# Altium schematic sheet WIFI_Display.SchDoc: WIFI, Display, Encoder
size A4; Date: 18.12.2015; Engineer: Matjaz Tome; DocumentNumber: 7; Revision: B1; SheetNumber: 7; SheetTotal: 8; Project: USB DAQ
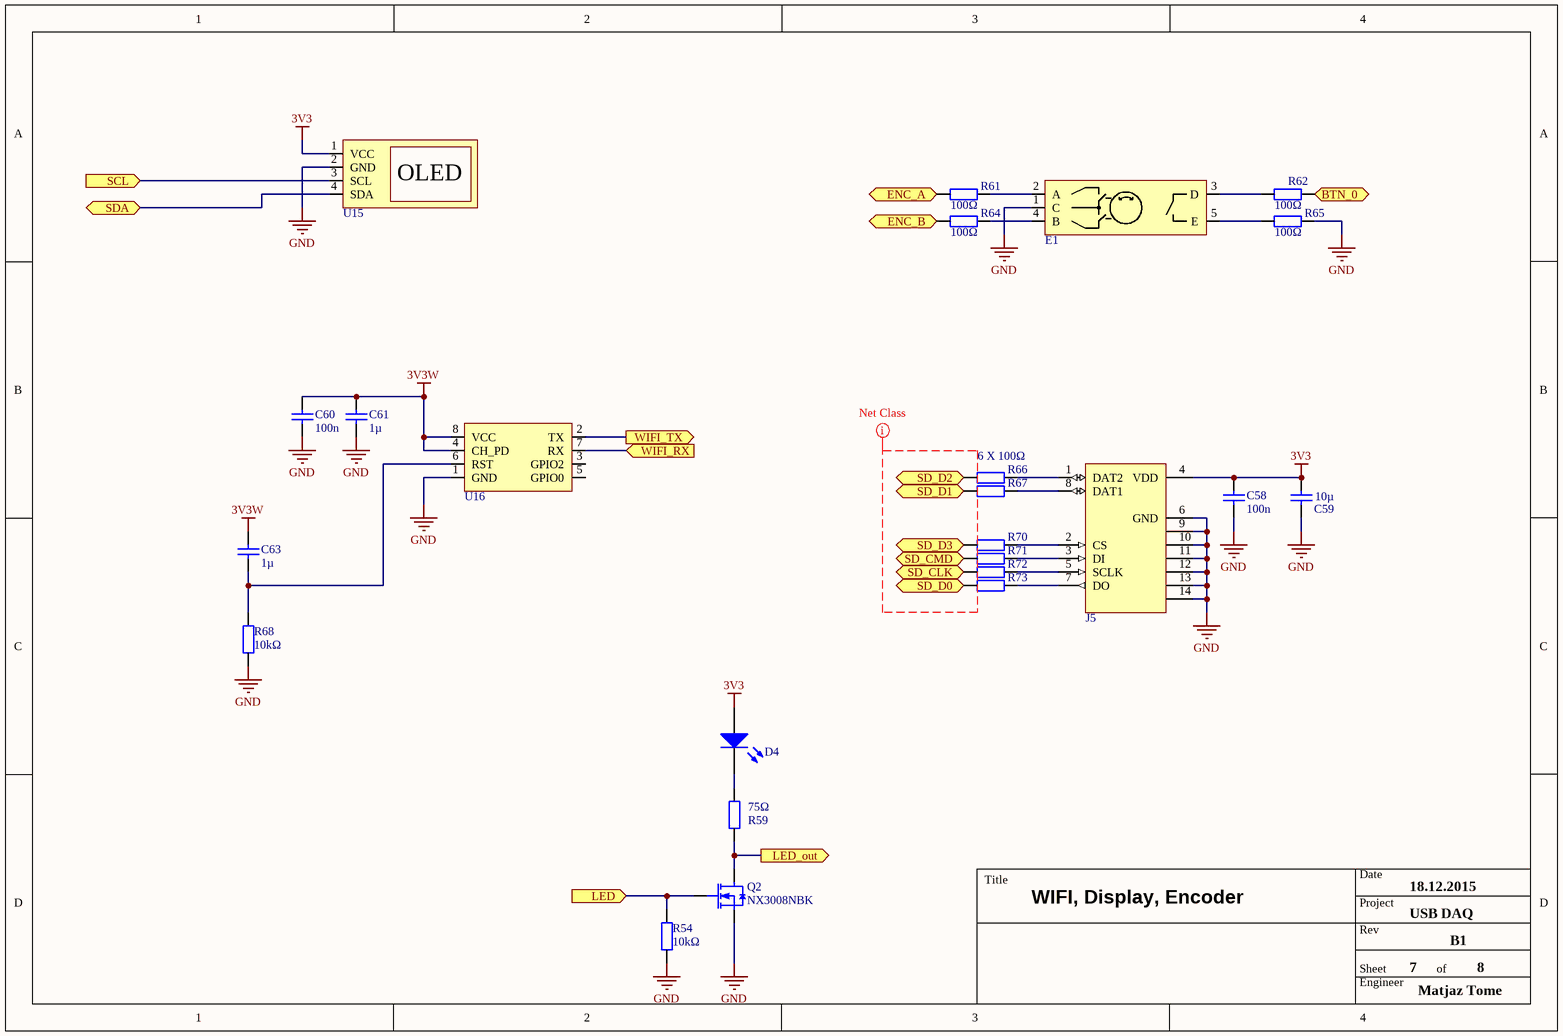
[diagram p0: WIFI_Display.SchDoc]

## Parts
C58  100n  [0603C]
C59  10µ  [0805C]
C60  100n  [0603C]
C61  1µ  [0603C]
C63  1µ  [0603C]
D4  KPT-2012SGC  [LED0805]  (value not drawn)
E1  EC12D  [EC12D]  (value not drawn)
J5  SD card  [MICRO_SD_AMPHENOL]  (value not drawn)
Q2  NX3008NBK  [SOT23-3]
R54  10kΩ  [0603R]
R59  75Ω  [0603R]
R61  100Ω  [0603R]
R62  100Ω  [0603R]
R64  100Ω  [0603R]
R65  100Ω  [0603R]
R66  100Ω  [0603R]  (value not drawn)
R67  100Ω  [0603R]  (value not drawn)
R68  10kΩ  [0603R]
R70  100Ω  [0603R]  (value not drawn)
R71  100Ω  [0603R]  (value not drawn)
R72  100Ω  [0603R]  (value not drawn)
R73  100Ω  [0603R]  (value not drawn)
U15  SSD1306  [OLED1]  (value not drawn)
U16  ESP-01  [ESP-01]  (value not drawn)

## Ports
BTN_0 (out), ENC_A (out), ENC_B (out), LED (in), LED_out (out), SCL (in), SD_CLK (in), SD_CMD (in), SD_D0 (bidir), SD_D1 (bidir), SD_D2 (bidir), SD_D3 (bidir), SDA (bidir), WIFI_RX (in), WIFI_TX (out)

## Nets
3V3: C58.1 C59.2 D4.A J5.4(VDD) U15.1(VCC)
3V3W: C60.1 C61.2 C63.2 U16.4(CH_PD) U16.8(VCC)
GND: C58.2 C59.1 C60.2 C61.1 E1.1(C) J5.6(GND) J5.9 J5.10 J5.11 J5.12 J5.13 J5.14 Q2.2(S) R54.1 R65.2 R68.1 U15.2(GND) U16.1(GND)
BTN_0: R62.2 ; port BTN_0
ENC_A: R61.1 ; port ENC_A
ENC_B: R64.1 ; port ENC_B
LED: Q2.1(G) R54.2 ; port LED
LED_out: Q2.3(D) R59.1 ; port LED_out
SCL: U15.3(SCL) ; port SCL
SD_CLK: R72.1 ; port SD_CLK
SD_CMD: R71.1 ; port SD_CMD
SD_D0: R73.1 ; port SD_D0
SD_D1: R67.1 ; port SD_D1
SD_D2: R66.1 ; port SD_D2
SD_D3: R70.1 ; port SD_D3
SDA: U15.4(SDA) ; port SDA
WIFI_RX: U16.7(RX) ; port WIFI_RX
WIFI_TX: U16.2(TX) ; port WIFI_TX
NetC63_1: C63.1 R68.2 U16.6(RST)
NetD4_K: D4.K R59.2
NetE1_2: E1.2(A) R61.2
NetE1_3: E1.3(D) R62.1
NetE1_4: E1.4(B) R64.2
NetE1_5: E1.5(E) R65.1
NetJ5_1: J5.1(DAT2) R66.2
NetJ5_2: J5.2(CS) R70.2
NetJ5_3: J5.3(DI) R71.2
NetJ5_5: J5.5(SCLK) R72.2
NetJ5_7: J5.7(DO) R73.2
NetJ5_8: J5.8(DAT1) R67.2

Not connected (* = marked no-connect by the designer): U16 3(GPIO2) 5(GPIO0)

## Layout directives
net class SD_CARD: (no net found under the mark)

## Notes on the sheet
- (near R66) 6 X 100Ω
- Title
- Date
- Project
- Rev
- Engineer
- Sheet
- of
- (in symbol OLM0000) OLED

## Library data of the parts
C58 C60 = RSC0013: ceramic X7R SMD capacitor smd 0603 100nF 16V; Manufacturer: Murata; Manufacturer Number: GRM188R71C104KA01D; Dealer number: 1828890; Dealer: Farnell; Tolerance: 10%; Part Number: RSC0013; Category: capacitors; Price: 0.042; Value: 100nF; Voltage: 16V; Case: 0603; Technology: SMT; Dielectric: X7R; HelpURL: U:\datasheet\cap\Murata\GRM\GRM188R71C104KA01D.pdf; Supplier 1: Farnell; Supplier Part Number 1: 1828890
C59 = VSC0001: ceramic Y5V SMD capacitor smd 0805 10µF 6.3V; Manufacturer: Multicomp; Manufacturer Number: MC0805F106Z6R3CT; Tolerance: +80 -20%; Part Number: VSC0001; Category: capacitors; Price: 0.04; Value: 10µF; Voltage: 6.3V; Case: 0805; Technology: SMT; Dielectric: Y5V; HelpURL: U:\datasheet\cap\MULTICOMP_1.pdf; Supplier Part Number 1: 1759136; Supplier 1: Farnell
C61 C63 = ZSC0003: ceramic X5R SMD capacitor smd 0603 1µF 50V; Manufacturer: Murata; Manufacturer Number: GRM188R61H105KAALD; Tolerance: 10%; Part Number: ZSC0003; Category: capacitors; Price: 0.144; Value: 1µF; Voltage: 50V; Case: 0603; Technology: SMT; Dielectric: X5R; HelpURL: U:\datasheet\cap\Murata\GRM\GRM188R61H105KAALD.pdf; SKU: 1020300000001; Supplier part number 1: 1845736; Supplier 1: Farnell
D4 = XXL0000: Green led SMD 0805; Manufacturer: Kingbright; Dealer number: 2099239; Dealer: Farnell; If: 20mA; Uf: 2.2V; Luminous Intensity: 12mcd; Part Number: XXL0000; Category: Led; Price: 0.068; Manufacturer Number: KPT-2012SGC; Color: Green; Case: 0805; Technology: SMT; HelpURL: U:\datasheet\led\KPT-2012SGC.pdf; SKU: 5500000000000; Supplier 1: Farnell; Supplier part number 1: 2099239
E1 = XRE0000: Rotary encoder with push button; Manufacturer: Alps; Manufacturer Number: EC12D1564402; Part Number: XRE0000; Category: Rotary encoders; Price: 0.89; Technology: THT; HelpURL: U:\datasheet\rotary_encoders\ec12.pdf; Supplier part number 1: 2065075; Supplier 1: Farnell
J5 = XMC0000: Micro SD card connector; Manufacturer: Amphenol; Manufacturer Number: 114-00841-68; Part Number: XMC0000; Category: connectors; Price: 2.17; Card type: Micro SD; Technology: SMT; HelpURL: U:\datasheet\memory_cards\amphenol_micro_sd.pdf; Supplier part number 1: 2293708; Supplier 1: Farnell
Q2 = XMN0003: 30V 0.4A N-mosfet; Manufacturer: NXP; RDS: 1Ω; Max power disipation: 350mW; Type: N-enhancment mode; Logic level: Yes; Part Number: XMN0003; Category: mosfets; Supplier part number 1: 2069541; Supplier 1: Farnell; Price: 0.053; Manufacturer Number: NX3008NBK; Max voltage: 30V; Max current: 0.4A; Case: SOT23-3; Technology: SMT; HelpURL: U:\datasheet\nmos\NX3008NBK.pdf
R54 R68 = YRS0016: resistor smd 0603 10kΩ 1% 0.1w; Manufacturer: Vishay; Manufacturer Number: CRCW060310K0FKEA; Dealer number: 1469748; Dealer: Farnell; Temperature coefficient: 100ppm; Part Number: YRS0016; Category: resistors; Price: 0.0143€; Value: 10kΩ; Power: 0.1W; Tolerance: 1%; Case: 0603; Technology: SMT; Material: Metal film - thick / Metal film; HelpURL: U:\datasheet\res\VISHAY CRCW0603.pdf; SKU: 1000000000002; Supplier 1: Farnell; Supplier part number 1: 1469748
R59 = XRS0024: resistor smd 0603 75Ω 5% 0.1w; Manufacturer: Multicomp; Manufacturer Number: MCMR06X750 JTL; Temperature coefficient: 100ppm; Part Number: XRS0024; Category: resistors; Price: 0.008€; Value: 75Ω; Power: 0.1W; Tolerance: 5%; Case: 0603; Technology: SMT; Material: Metal film / Metal film; HelpURL: U:\datasheet\res\MULTICOMP 0603.pdf; Supplier part number 1: 2073569; Supplier 1: Farnell
R61 R62 R64-R67 R70-R73 = XRS0016: resistor smd 0603 100Ω 5% 0.1w; Manufacturer: Multicomp; Manufacturer Number: MCMR06X101 JTL; Temperature coefficient: 100ppm; Part Number: XRS0016; Category: resistors; Price: 0.009€; Value: 100Ω; Power: 0.1W; Tolerance: 5%; Case: 0603; Technology: SMT; Material: Metal film / Metal film; HelpURL: U:\datasheet\res\MULTICOMP 0603.pdf; Supplier part number 1: 2073352; Supplier 1: Farnell
U15 = OLM0000: Oled display module; Dealer: Ebay; Part Number: OLM0000; Category: Displays; Price: 7; Technology: THT; HelpURL: U:\datasheet\Oled_modules\SSD1306.pdf
U16 = XWM0000: WIFI module; Dealer: Ebay; Part Number: XWM0000; Category: WIFI modules; Price: 3.8; Technology: THT